# EAGLE design PocketQube (EAGLE 7.1.0)
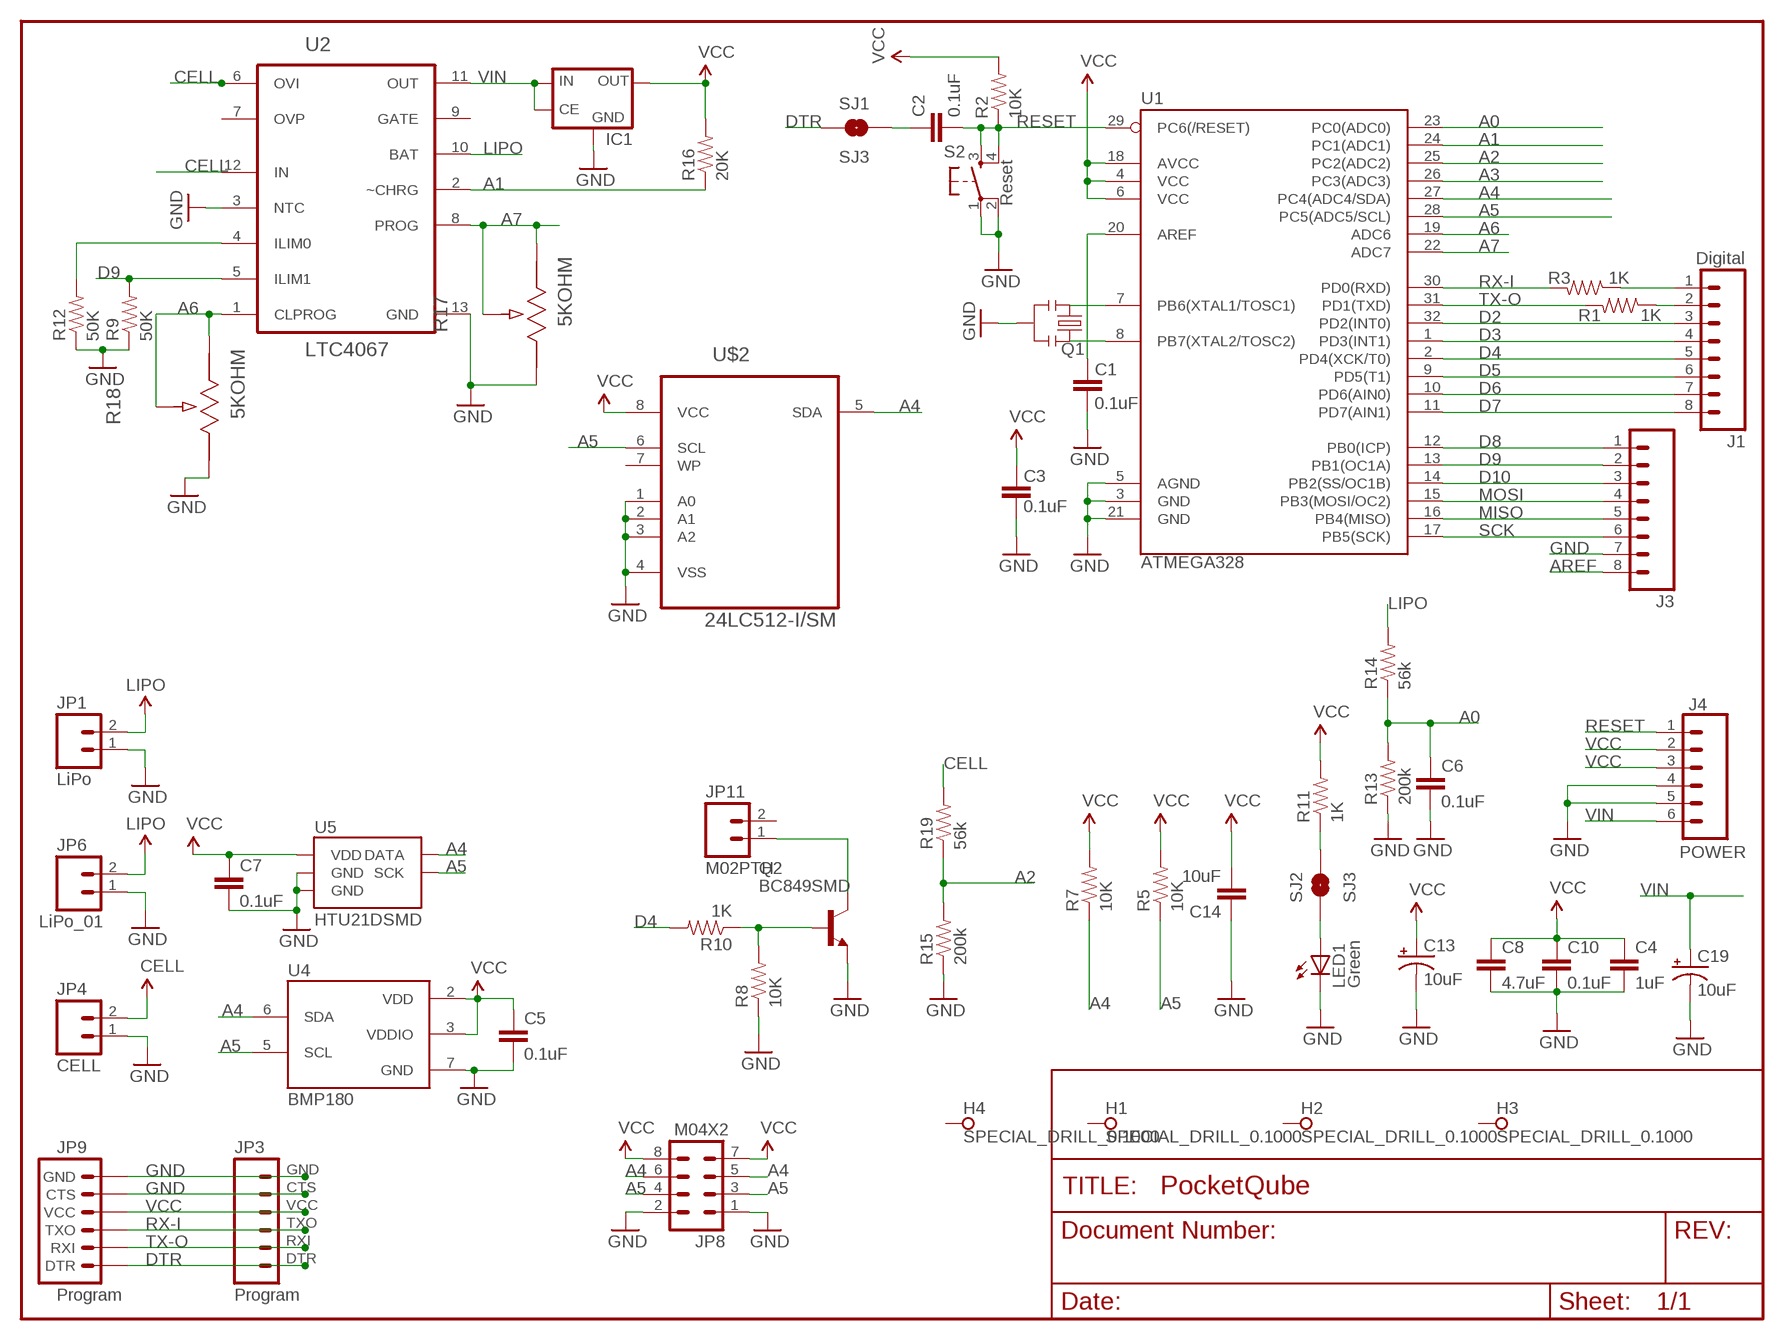
[diagram p0: schematic, sheet 1]

## Parts
C1  0.1uF  CAP0805  [0805]
C2  0.1uF  CAP0805  [0805]
C3  0.1uF  CAP0805  [0805]
C4  1uF  CAP0805  [0805]
C5  0.1uF  CAP0805  [0805]
C6  0.1uF  CAP0805  [0805]
C7  0.1uF  CAP0805  [0805]
C8  4.7uF  CAP0805  [0805]
C10  0.1uF  CAP0805  [0805]
C13  10uF  CAP_POL1206  [EIA3216]
C14  10uF  CAP0805  [0805]
C19  10uF  CAP_POL1206  [EIA3216]
H1  SPECIAL_DRILL_0.1000  [PAD_0.1000]
H2  SPECIAL_DRILL_0.1000  [PAD_0.1000]
H3  SPECIAL_DRILL_0.1000  [PAD_0.1000]
H4  SPECIAL_DRILL_0.1000  [PAD_0.1000]
IC1  XC63FPP  [SOT89R]
J1  Digital  M081X08  [1X08]
J3  M081X08  [1X08]
J4  POWER  M06SIP  [1X06]
JP1  LiPo  M02PTH  [1X02]
JP3  Program  M06SIP  [1X06]
JP4  CELL  M02PTH  [1X02]
JP6  LiPo_01  M02PTH  [1X02]
JP8  M04X2  [2X4]
JP9  Program  ARDUINO_SERIAL_PROGRAMSMD  [1X06-SMD]
JP11  M02PTH  [1X02]
LED1  Green  LG_T679-E1F1-1  [PLCC2]
Q1  8MHZ  RESONATOR8MHZ  [RESONATOR-SMD]
Q2  BC849SMD  [SOT23-BEC]
R1  1K  RESISTOR0805-RES  [0805]
R2  10K  RESISTOR0805-RES  [0805]
R3  1K  RESISTOR0805-RES  [0805]
R5  10K  RESISTOR0805-RES  [0805]
R7  10K  RESISTOR0805-RES  [0805]
R8  10K  RESISTOR0805-RES  [0805]
R9  50K  RESISTOR0805-RES  [0805]
R10  1K  RESISTOR0805-RES  [0805]
R11  1K  RESISTOR0805-RES  [0805]
R12  50K  RESISTOR0805-RES  [0805]
R13  200k  RESISTOR0805-RES  [0805]
R14  56k  RESISTOR0805-RES  [0805]
R15  200k  RESISTOR0805-RES  [0805]
R16  20K  RESISTOR0805-RES  [0805]
R17  5KOHM  EVM2NSX80B53-2N  [POT_EVM2N]
R18  5KOHM  EVM2NSX80B53-2N  [POT_EVM2N]
R19  56k  RESISTOR0805-RES  [0805]
S2  Reset  TAC_SWITCHSMD  [TACTILE_SWITCH_SMD]
SJ1  SJ3  SOLDERJUMPERNC2  [SJ_2S-NOTRACE]
SJ2  SJ3  SOLDERJUMPERNC2  [SJ_2S-NOTRACE]
U1  ATMEGA328  ATMEGA168  [TQFP32-08]
U2  LTC4067  LT3652EDDPBF  [DFN300X300X80-13N]
U4  BMP180  [BMP180]
U5  HTU21DSMD  [HTU21D]
U$2  24LC512-I/SM  [SOIC127P794X203-8N]

## Nets
A0: C6.1 R13.2 R14.1 U1.23(PC0(ADC0))
A1: R16.1 U1.24(PC1(ADC1)) U2.2(~CHRG)
A2: R15.2 R19.1 U1.25(PC2(ADC2))
A3: U1.26(PC3(ADC3))
A4: JP8.5 JP8.6 R7.1 U1.27(PC4(ADC4/SDA)) U4.6(SDA) U5.DATA U$2.5(SDA)
A5: JP8.3 JP8.4 R5.1 U1.28(PC5(ADC5/SCL)) U4.5(SCL) U5.SCK U$2.6(SCL)
A6: R18.2 R18.3 U1.19(ADC6) U2.1(CLPROG)
A7: R17.2 R17.3 U1.22(ADC7) U2.8(PROG)
AREF: C1.2 J3.8 U1.20(AREF)
CELL: JP4.2 R19.2 U2.6(OVI) U2.12(IN)
D2: J1.3 U1.32(PD2(INT0))
D3: J1.4 U1.1(PD3(INT1))
D4: J1.5 R10.2 U1.2(PD4(XCK/T0))
D5: J1.6 U1.9(PD5(T1))
D6: J1.7 U1.10(PD6(AIN0))
D7: J1.8 U1.11(PD7(AIN1))
D8: J3.1 U1.12(PB0(ICP))
D9: J3.2 R9.2 U1.13(PB1(OC1A)) U2.5(ILIM1)
D10: J3.3 U1.14(PB2(SS/OC1B))
DTR: JP3.DTR JP9.1(DTR) SJ1.1
GND [vcc]: C1.1 C3.1 C4.2 C5.2 C6.2 C7.2 C8.2 C10.2 C13.C(-) C14.1 C19.C(-) IC1.2(GND) J3.7 J4.4 J4.5 JP1.1 JP3.CTS JP3.GND JP4.1 JP6.1 JP8.1 JP8.2 JP9.5(CTS) JP9.6(GND) LED1.C Q1.2 Q2.E R8.1 R9.1 R12.1 R13.1 R15.1 R17.1 R18.1 S2.1 S2.2 U1.3(GND) U1.5(AGND) U1.21(GND) U2.3(NTC) U2.13(GND) U4.7(GND) U5.7(GND) U5.GND U$2.1(A0) U$2.2(A1) U$2.3(A2) U$2.4(VSS)
LIPO: JP1.2 JP6.2 R14.2 U2.10(BAT)
MISO: J3.5 U1.16(PB4(MISO))
MOSI: J3.4 U1.15(PB3(MOSI/OC2))
N$1: C2.1 SJ1.2
N$3: Q1.1 U1.8(PB7(XTAL2/TOSC2))
N$4: Q1.3 U1.7(PB6(XTAL1/TOSC1))
N$6: LED1.A SJ2.1
N$8: R11.1 SJ2.2
N$12: JP11.1 Q2.C
N$14: Q2.B R8.2 R10.1
N$16: R12.2 U2.4(ILIM0)
RESET: C2.2 J4.1 R2.1 S2.3 S2.4 U1.29(PC6(/RESET))
RX-I: JP3.TXO JP9.3(TXO) R3.2 U1.30(PD0(RXD))
RX-IP: J1.2 R1.1
SCK: J3.6 U1.17(PB5(SCK))
TX-O: JP3.RXI JP9.2(RXI) R1.2 U1.31(PD1(TXD))
TX-OP: J1.1 R3.1
VCC: C3.2 C4.1 C5.1 C7.1 C8.1 C10.1 C13.A(+) C14.2 IC1.5(OUT) J4.2 J4.3 JP3.VCC JP8.7 JP8.8 JP9.4(VCC) R2.2 R5.2 R7.2 R11.2 R16.2 U1.4(VCC) U1.6(VCC) U1.18(AVCC) U4.2(VDD) U4.3(VDDIO) U5.VDD U$2.8(VCC)
VIN [vcc]: C19.A(+) IC1.1(CE) IC1.4(IN) J4.6 U2.11(OUT)
Unconnected: H1.1 H2.1 H3.1 H4.1 JP11.2 U2.7(OVP) U2.9(GATE) U$2.7(WP)

## Library data of the parts
C1-C8 C10 = SparkFun:CAP: Capacitor Standard 0603 ceramic capacitor, and 0.1" leaded capacitor.
C13 C19 = SparkFun:CAP_POL: Capacitor Polarized These are standard SMD and PTH capacitors. Normally 10uF, 47uF, and 100uF in electrolytic and tantalum varieties. Always verify the external diameter of the through hole cap, it varies with capacity, voltage, and manufacturer. The EIA devices should be standard.
C14 = SparkFun-Passives:CAP: Capacitor Standard 0603 ceramic capacitor, and 0.1" leaded capacitor.
H1-H4 = special-drill:SPECIAL_DRILL_: Special drills
IC1 = SOT89-5:XC63FP: Positiv Voltage Regulators www.torex.co.jp/english/product/pro02/pdf/0201_xc62fp.pdf
J1 J3 = SparkFun:M08: Header 8 Standard 8-pin 0.1" header. Use with straight break away headers (SKU : PRT-00116), right angle break away headers (PRT-00553), swiss pins (PRT-00743), machine pins (PRT-00117), and female headers (PRT-00115).
J4 = SparkFun:M06: Header 6 Standard 6-pin 0.1" header. Use with straight break away headers (SKU : PRT-00116), right angle break away headers (PRT-00553), swiss pins (PRT-00743), machine pins (PRT-00117), and female headers (PRT-00115). Molex polarized connector foot print use with SKU : PRT-08094 with associated ...
JP1 JP4 JP11 = SparkFun-Connectors:M02: Standard 2-pin 0.1" header. Use with - straight break away headers ( PRT-00116) - right angle break away headers (PRT-00553) - swiss pins (PRT-00743) - machine pins (PRT-00117) - female headers (PRT-00115) Molex polarized connector foot print use with: PRT-08233 with associated crimp pins and housings. 2.54_SCREWTERM for use with PRT-10571. 3.5mm Screw Terminal footprints for PRT-08084 5mm Screw Terminal footprints for use with PRT-08432
JP3 = SparkFun-Connectors:M06: Header 6 Standard 6-pin 0.1" header. Use with straight break away headers (SKU : PRT-00116), right angle break away headers (PRT-00553), swiss pins (PRT-00743), machine pins (PRT-00117), and female headers (PRT-00115). Molex polarized connector foot print use with SKU : PRT-08094 with associated ...
JP6 = SparkFun:M02: Header 2 Standard 2-pin 0.1" header. Use with straight break away headers (SKU : PRT-00116), right angle break away headers (PRT-00553), swiss pins (PRT-00743), machine pins (PRT-00117), and female headers (PRT-00115). Molex polarized connector foot print use with SKU : PRT-08233 with associated crimp pins and housings.
JP8 = SparkFun-Connectors:M04X2: .1" header, two rows of four.
JP9 = SparkFun:ARDUINO_SERIAL_PROGRAM
LED1 = led:*_T679-?-1: LC TOPLED® Low Current LED Source: http://catalog.osram-os.com .. LG_LS_LY_T679_OBS.pdf; COLOR: green
Q1 = SparkFun-FreqCtrl:RESONATOR: Resonator Small SMD resonator. Used, eg, on the Arduino Pro/ Pro Mini boards. 8MHz- XTAL-08895 16MHz- XTAL-08900; PROD_ID: XTAL-08895
Q2 = transistor-npn:BC849*: NPN Transistor
R1-R3 R5 R7-R16 R19 = SparkFun:RESISTOR: Resistor Basic schematic elements and footprints for 0603, 1206, and PTH resistors.
R17 R18 = Panasonic-Trimmer_Potentiometers:EVM: Potentiometers; MPN: EVM2NSX80B53; OC_FARNELL: 1849757; OC_NEWARK: 17T5164; PACKAGE: EVM2N; POWERRATING: 0.15W; SUPPLIER: PANASONIC; TOLERANCE: ±25 %
S2 = SparkFun:TAC_SWITCH: Momentary Switch Button commonly used for reset or general input. Spark Fun Electronics SKU : COM-00097
SJ1 SJ2 = SparkFun:SOLDERJUMPER: Solder Jumper Standard SMD solder jumper. Used to automate production. Two varients : Normally Open and Normally Closed are the same, but have different paste layers. NC will have a large amount of paste and should jumper during reflow.
U1 = SparkFun:ATMEGA168
U2 = LTC3067:LT3652EDDPBF: Power Tracking 2A Battery Charger for Solar Power; MPN: LT3652EDD#PBF; OC_FARNELL: 2295370; OC_NEWARK: 62R9142; PACKAGE: DFN-12; SUPPLIER: Linear Technology
U4 = SparkFun-Sensors:BMP180: BOSCH BMP180 DIGITAL BAROMETRIC PRESSURE SENSOR Web page: http://www.bosch-sensortec.com/en/homepage/products_3/environmental_sensors_1/bmp180_1/bmp180 Datasheet: http://ae-bst.resource.bosch.com/media/products/dokumente/bmp180/BST-BMP180-DS000-09.pdf The BMP180 is the function compatible successor of the BMP085, a new generation of high precision digital pressure sensors for consumer applications. The ultra-low power, low voltage electronics of the BMP180 is optimized for use in mobile phones, PDAs, GPS navigation devices and outdoor equipment. With a low altitude noise of merely 0.25m at fast conversion time, the BMP180 offers superior performance. The I2C interface allows for easy system integration with a microcontroller. The BMP180 is based on piezo-resistive technology for EMC robustness, high accuracy and linearity as well as long term stability. Key features: - Temperature measurement included - I2C interface - Fully calibrated - Pb-free, halogen-free and RoHS compliant, - MSL 1 Basic specs: Pressure range: 300 to 1100hPa (+9000m to -500m relating to sea level) Supply voltage: 1.8 to 3.6V (VDD), 1.62V to 3.6V (VDDIO) Package: LGA package with metal lid Small footprint: 3.6mm x 3.8mm Super-flat: 0.93mm height Low power: 5μA at 1 sample / sec. in standard mode Low noise: 0.06hPa (0.5m) in ultra low power mode, 0.02hPa (0.17m) advanced resolution mode Typical applications: - Enhancement of GPS navigation (dead-reckoning, slope detection, etc.) - In- and out-door navigation - Leisure and sports - Weather forecast - Vertical velocity indication (rise/sink speed)
U5 = SparkFun-Sensors:HTU21D
U$2 = 24LC512-I:24LC512-I/SM: 512K I2C Serial EEPROM; MPN: 24LC512-I/SM; OC_FARNELL: 9758038; OC_NEWARK: 62K0582; PACKAGE: SOIC-8; SUPPLIER: MICROCHIP

## Net classes
0 default: width 0.203 mm
1 vcc: width 0.254 mm

## Board
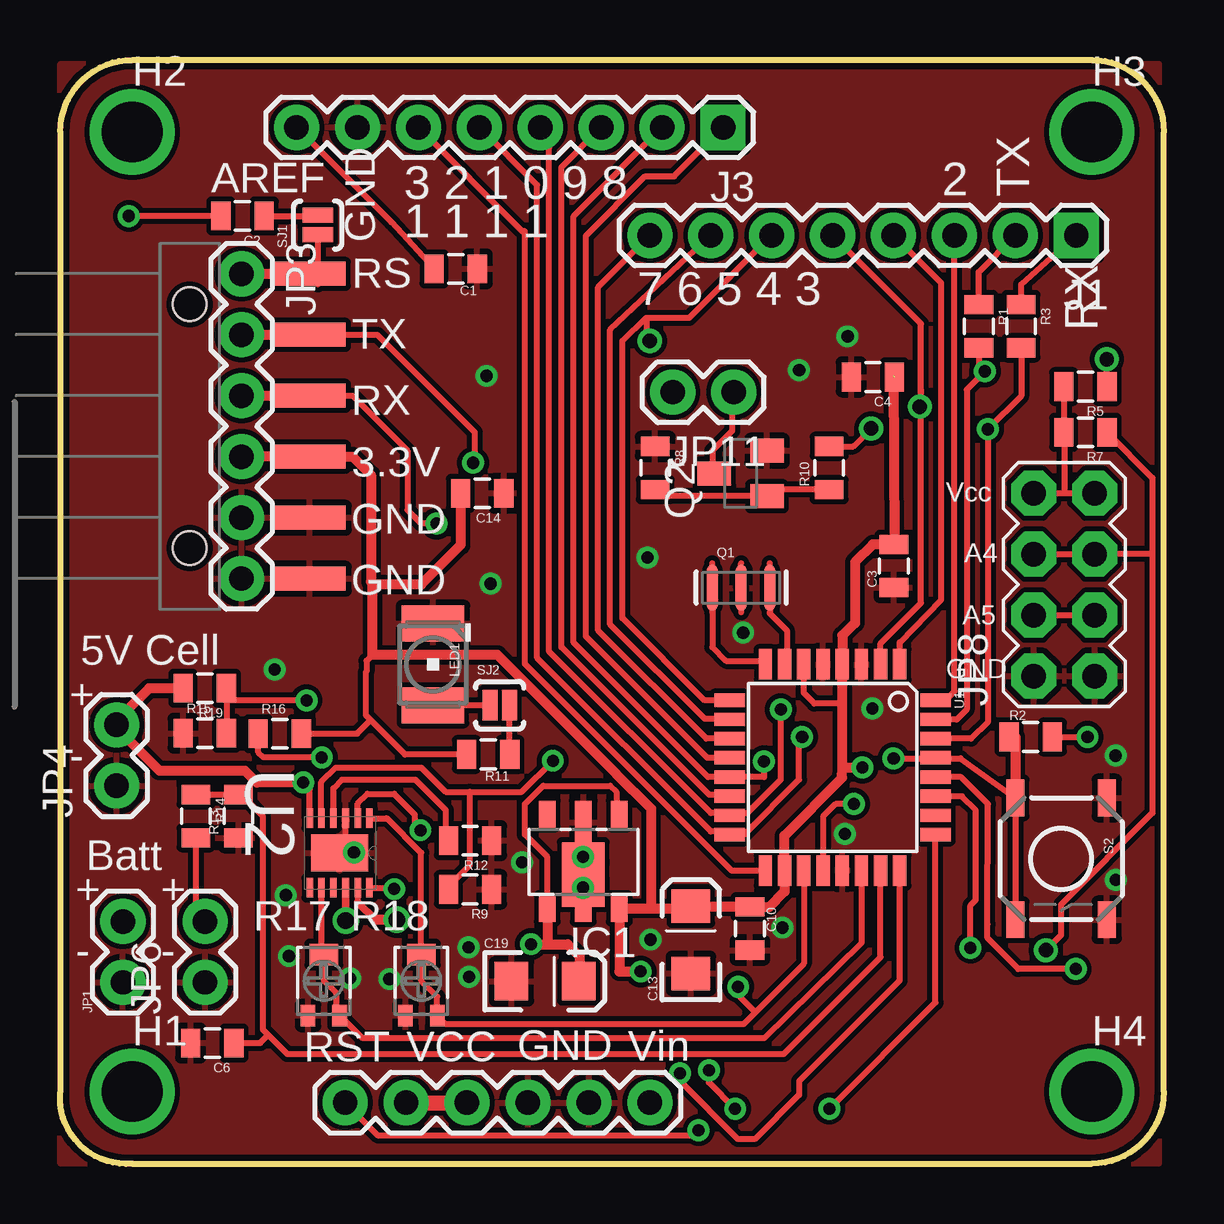
[diagram p1: board, top side]
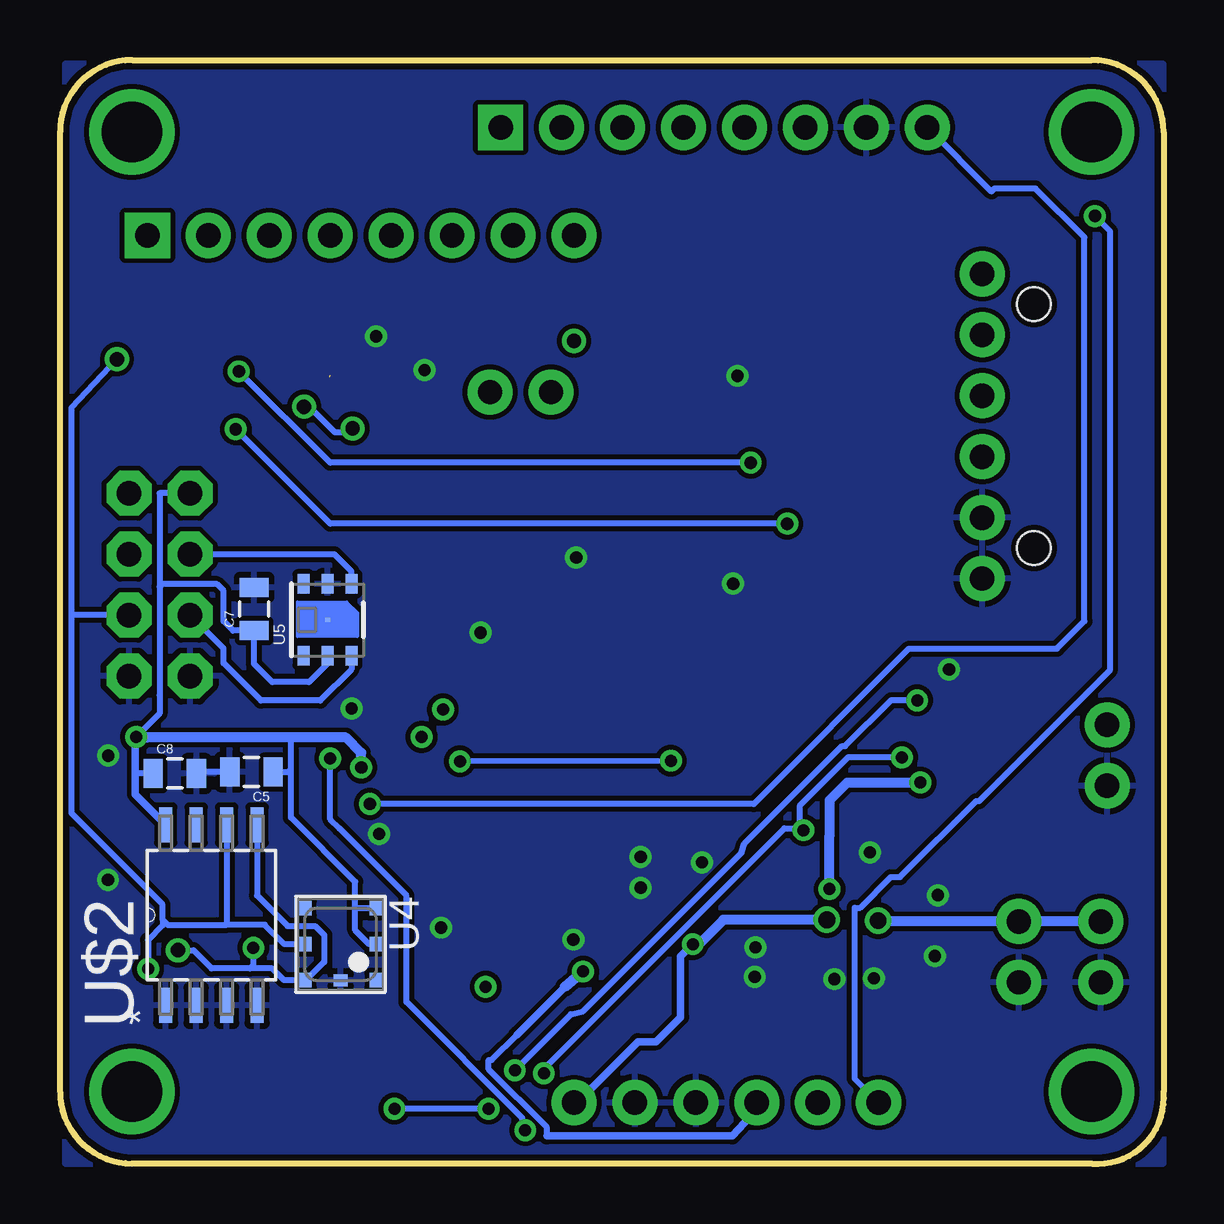
[diagram p2: board, bottom side, seen from below]

Size 46.01 x 46.01 mm. Coordinates in mm from the lower left corner, seen from the top.
Outline: 3.01,0.01 43.01,0.01 arc90 46.01,3.01 46.01,43.01 arc90 43.01,46.01 3.01,46.01 arc90 0.01,43.01 0.01,3.01 arc100 3.01,0.01
Copper layers (1*16): Top 0.035mm / dielectric 1.5mm / Bottom 0.035mm
Design rules "default *": minimum track width 10mil, minimum drill 24mil, track to track 8mil, track to pad 8mil, pad to pad 8mil, via to via 8mil, smd to smd 8mil, copper to edge 10mil, drill to drill 8mil, minimum pad ring 10mil, minimum via ring 8mil, stop-mask expansion 4mil, vias tented up to drill 0mil, thermal gap 10mil

### Footprints (pad centres in the part's own frame; a part is rotated, then mirrored left to right if it is on the bottom)
0805 = smd 0.8 x 1.2: 1 -0.9,0; 2 0.9,0
EIA3216 = smd 1.4 x 1.6: A 1.4,0; C -1.4,0
PAD_0.1000 = drill 2.54 pad 2.54: 1 0,0
SOT89R = smd 0.7 x 1.1: 1 -1.5,-1.75; 3 1.5,-1.75; 4 1.5,2.187; 5 -1.5,2.187 | smd 0.7 x 1.8: 2 0,-1.4; 7 0,1.839 | smd 1.778 x 0.914: 6 0,1.408; 8 0,-0.116; 9 0,0.646; 10 0,1.662
1X08 = drill 1.016 pad 1.88 square: 1 0,0 | drill 1.016 pad 1.88: 2 2.54,0; 3 5.08,0; 4 7.62,0; 5 10.16,0; 6 12.7,0; 7 15.24,0; 8 17.78,0
1X06 = drill 1.016 pad 1.88: 1 0,0; 2 2.54,0; 3 5.08,0; 4 7.62,0; 5 10.16,0; 6 12.7,0
1X02 = drill 1.016 pad 1.88: 1 0,0; 2 2.54,0
1X06' = drill 1.016 pad 1.88: CTS 10.16,0; DTR 0,0; GND 12.7,0; RXI 2.54,0; TXO 5.08,0; VCC 7.62,0
2X4 = drill 1.016 pad 1.88 octagon: 1 -3.81,-1.27; 2 -3.81,1.27; 3 -1.27,-1.27; 4 -1.27,1.27; 5 1.27,-1.27; 6 1.27,1.27; 7 3.81,-1.27; 8 3.81,1.27
1X06-SMD = smd 1 x 3: 1 -6.35,5; 2 -3.81,5; 3 -1.27,5; 4 1.27,5; 5 3.81,5; 6 6.35,5 | hole 1.4: -5.08,0; 5.08,0
PLCC2 = smd 2.6 x 1.5: A 0,1.7; C 0,-1.7
RESONATOR-SMD = smd 0.45 x 1.905: 1 -1.2,0; 2 0,0; 3 1.2,0
SOT23-BEC = smd 1 x 1.4: B -0.95,-1.1; C 0,1.1; E 0.95,-1.1
POT_EVM2N = smd 0.61 x 0.889: 1 -0.66,-1.448; 3 0.66,-1.448 | smd 1.194 x 0.889: 2 0,1.092
TACTILE_SWITCH_SMD = smd 1.524 x 0.762: 1 -2.54,1.905; 2 2.54,1.905; 3 -2.54,-1.905; 4 2.54,-1.905
SJ_2S-NOTRACE = smd 0.635 x 1.27: 1 -0.401,0; 2 0.413,0
TQFP32-08 = smd 1.27 x 0.559: 1 -4.293,2.8; 2 -4.293,2; 3 -4.293,1.2; 4 -4.293,0.4; 5 -4.293,-0.4; 6 -4.293,-1.2; 7 -4.293,-2; 8 -4.293,-2.8; 17 4.293,-2.8; 18 4.293,-2; 19 4.293,-1.2; 20 4.293,-0.4; 21 4.293,0.4; 22 4.293,1.2; 23 4.293,2; 24 4.293,2.8 | smd 0.559 x 1.27: 9 -2.8,-4.293; 10 -2,-4.293; 11 -1.2,-4.293; 12 -0.4,-4.293; 13 0.4,-4.293; 14 1.2,-4.293; 15 2,-4.293; 16 2.8,-4.293; 25 2.8,4.293; 26 2,4.293; 27 1.2,4.293; 28 0.4,4.293; 29 -0.4,4.293; 30 -1.2,4.293; 31 -2,4.293; 32 -2.8,4.293
DFN300X300X80-13N = smd 0.813 x 0.279: 1 -1.448,1.218; 2 -1.448,0.736; 3 -1.448,0.229; 4 -1.448,-0.279; 5 -1.448,-0.786; 6 -1.448,-1.268; 7 1.448,-1.268; 8 1.448,-0.786; 9 1.448,-0.279; 10 1.448,0.229; 11 1.448,0.736; 12 1.448,1.218 | smd 1.549 x 2.388: 13 0,-0.025
BMP180 = smd 0.6 x 0.5: 1 1.5,1.45; 2 0,1.45; 3 -1.5,1.45; 4 -1.5,-1.45; 5 0,-1.45; 6 1.5,-1.45 | smd 0.5 x 0.6: 7 1.5,0
HTU21D = smd 0.2 x 0.2: 7 0,0 | smd 0.8 x 0.5: DATA 1.5,-1; GND 1.5,0; NC@1 -1.5,1; NC@6 1.5,1; SCK -1.5,-1; VDD -1.5,0
SOIC127P794X203-8N = smd 1.473 x 0.559: 1 -3.759,1.905; 2 -3.759,0.635; 3 -3.759,-0.635; 4 -3.759,-1.905; 5 3.759,-1.905; 6 3.759,-0.635; 7 3.759,0.635; 8 3.759,1.905

### Placement (x,y rotation side)
C1  16.49,37.3 180 top
C2  7.61,39.51 180 top
C3  34.76,24.92 90 top
C4  33.88,32.8 180 top
C5  38.03,16.33 180 bottom
C6  6.35,5.03 180 top
C7  37.92,23.13 90 bottom
C8  41.22,16.27 0 bottom
C10  28.76,9.81 270 top
C13  26.29,9.33 90 top
C14  17.6,27.95 180 top
C19  20.22,7.61 0 top
H1  3.01,3.01 0 top
H2  3.01,43.01 0 top
H3  43.01,43.01 0 top
H4  43.01,3.01 0 top
IC1  21.82,12.83 180 top
J1  42.37,38.7 180 top
J3  27.64,43.2 180 top
J4  11.89,2.55 0 top
JP1  2.62,7.56 90 top
JP3  Program  [1X06']  7.57,37.1 270 top
JP4  2.36,15.76 90 top
JP6  6.04,7.56 90 top
JP8  41.86,24.14 90 top
JP9  5.41,30.75 270 top
JP11  28.08,32.17 180 top
LED1  15.55,20.81 180 top
Q1  28.39,24.01 0 top
Q2  28.38,28.78 90 top
R1  38.3,34.91 270 top
R2  40.46,17.79 0 top
R3  40.06,34.91 270 top
R5  42.75,32.4 180 top
R7  42.75,30.49 180 top
R8  24.81,29.01 270 top
R9  17.09,11.44 180 top
R10  32.07,29 90 top
R11  17.85,17.06 180 top
R12  17.09,13.47 180 top
R13  7.44,14.49 90 top
R14  5.66,14.49 270 top
R15  6.04,17.95 0 top
R16  9.16,17.93 0 top
R17  11,7.63 0 top
R18  15.06,7.63 0 top
R19  6.04,19.82 180 top
S2  41.73,12.71 270 top
SJ1  10.74,39.13 90 top
SJ2  18.33,19.11 0 top
U1  32.21,16.52 270 top
U2  11.68,12.95 270 top
U4  34.31,9.15 270 bottom
U5  34.86,22.68 90 bottom
U$2  39.7,10.37 90 bottom

### Tracks (layer width: path | path; a pad name or v marks a point on that pad's centre or on a via)
A0
  Top 0.254: U1.23 34.21,8.62 30.17,4.58 29.16,4.58 9.47,4.58 8.68,5.37 | R14.1 R13.2 7.33,15.25 7.7,15.25 8.46,14.49 8.46,5.6 8.68,5.37 | C6.1 8.35,5.03 8.68,5.37
A1  (via drill 0.5 pad 0.41)
  Top 0.254: U1.24 35.01,7.64 30.81,3.44 30.81,2.87 28.97,1.03 28.27,1.03 25.84,3.45 v25.84,3.78 | v15.02,13.9 14.84,13.9 14.78,13.96 14.78,14.56 13.93,15.42 12.82,15.42 12.41,15.02 U2.2 | v10.91,16.94 8.48,16.94 8.27,17.15 R16.1
  Bottom 0.254: v10.91,16.94 13.16,16.94 15.19,14.91 15.19,14.07 v15.02,13.9 15.1,13.98 15.82,13.98 25.84,3.96 v25.84,3.78
A2  (via drill 0.5)
  Top 0.254: U1.25 36.5,6.73 v32.07,2.3 | 6.79,18.06 R15.2 6.94,17.82 R19.1 7.06,19.32 v10.28,19.32 | v27.05,3.9 27.05,3.39 v28.14,2.3
  Bottom 0.254: v27.05,3.9 24.71,6.23 24.21,6.36 17.6,12.97 17.47,13.35 13.41,17.41 13.28,17.41 11.38,19.32 v10.28,19.32 | v28.14,2.3 v32.07,2.3
A4  (via drill 0.5, 0.6)
  Top 0.254: U1.27 37.6,15.32 38.18,14.74 38.18,11 37.95,10.77 v37.95,9 | R7.1 43.65,30.48 45.54,28.59 45.54,25.41 | 45.54,25.41 JP8.5 JP8.6 | 45.54,25.41 45.54,14.62 41.73,10.81 41.73,9.54 v41.1,8.9
  Bottom 0.254: U5.DATA 33.86,24.7 34.57,25.41 JP8.6 | v41.1,8.9 40.45,8.9 39.69,8.15 38.09,8.15 | 38.09,8.15 37.16,8.15 36.67,7.65 U4.6 35,8.42 35,9.54 35.38,9.92 36.52,9.92 37.79,11.19 37.79,14.11 U$2.5 | v37.95,9 37.95,8.28 38.09,8.15
A5  (via drill 0.5, 0.6)
  Top 0.254: U1.28 37.56,16.12 38.68,15 38.66,9.99 38.66,9.41 39.95,8.12 v42.34,8.12 | v43.64,33.54 43.64,32.4 R5.1 | JP8.4 JP8.3
  Bottom 0.254: JP8.3 45.54,22.87 | 45.54,22.87 45.54,14.62 41.73,10.81 41.73,10.17 | v43.64,33.54 45.54,31.51 45.54,22.87 | 41.73,10.17 41.5,9.94 39.09,9.94 39.06,9.97 | U5.SCK 33.86,20.61 35.16,19.31 37.63,19.31 39.2,20.87 39.2,21.48 JP8.4 | 41.73,10.17 41.73,9.93 42.34,9.32 v42.34,8.13 v42.34,8.12 | U$2.6 39.06,9.97 | U4.5 36.66,9.15 37.47,9.97 39.06,9.97
A6  (via drill 0.5)
  Top 0.254: U1.19 31.01,8.34 28.99,6.32 | v28.27,7.38 28.27,7.03 28.99,6.32 | U2.1 13.6,14.4 13.61,14.41 15.06,12.97 R18.2 15.06,7.63 15.72,6.97 R18.3 16.08,5.82 28.49,5.82 28.99,6.32
A7
  Top 0.254: U1.22 33.41,9.21 29.35,5.24 12.62,5.23 R17.3 11.51,6.34 11.51,7.12 11,7.63 R17.2 10.89,8.83 U2.8
AREF  (via drill 0.51)
  Top 0.254: U1.20 31.81,14.47 32.33,15 v33.1,15 | C1.2 13.82,39.25 J3.8
  Bottom 0.254: v33.1,15 17.09,15 10.62,21.47 4.46,21.47 3.31,22.62 3.31,38.62 5.35,40.65 7.06,40.65 7.19,40.52 J3.8
CELL  (via drill 0.5, 0.5 pad 0.41)
  Top 0.254: U2.12 13.61,11.51 v13.94,11.45 | U2.6 10.41,15.62 v10.14,15.89 | 2.69,17.84 2.69,17.97 JP4.2
  Top 0.406: v10.14,15.89 8.21,15.89 7.71,16.39 4.14,16.39 2.69,17.84 | R19.2 3.71,19.82 2.69,18.8 2.62,18.8 2.62,18.56 JP4.2
  Bottom 0.406: v13.94,11.45 13.94,13.69 13.93,13.69 13.93,15.15 13.19,15.89 v10.14,15.89
D2
  Top 0.254: U1.32 36.9,19.32 36.91,19.32 37.29,19.7 J1.3
D3
  Top 0.254: U1.1 35.01,21.73 36.73,23.51 36.73,36.71 J1.4
D4  (via drill 0.6)
  Top 0.254: U1.2 34.21,21.7 35.89,23.38 35.89,32.27 | 35.89,32.27 35.89,35.02 J1.5 | 35.89,32.27 v35.84,31.56 | R10.2 33.06,29.9 v33.81,30.65
  Bottom 0.254: v35.84,31.56 35.62,31.56 34.56,30.49 33.97,30.49 v33.81,30.65
D5  (via drill 0.6)
  Top 0.254: U1.9 28.02,19.32 | U1.9 | U1.9 26.87,19.32 23.44,22.74 23.44,34.3 24.44,35.26 | 24.44,35.26 26.23,35.26 J1.6 | 24.44,35.26 24.44,34.44 v24.59,34.3
D6
  Top 0.254: U1.10 27.79,18.52 27.76,18.55 26.87,18.55 22.94,22.49 22.94,34.76 J1.7
D7
  Top 0.254: U1.11 26.94,17.72 22.43,22.24 22.43,36.54 J1.8
D8
  Top 0.254: U1.12 26.98,16.92 21.92,21.98 21.92,38.68 24.4,41.16 25.6,41.16 J3.1
D9  (via drill 0.5)
  Top 0.254: v29.34,16.78 29.34,16.12 28.02,16.12 U1.13 27.02,16.12 21.41,21.73 21.41,39.51 J3.2 | R9.2 16.19,11.56 17.09,12.46 17.09,15.51 | 17.09,15.51 16.08,15.51 15.06,16.52 11.51,16.52 10.89,15.91 U2.5 | 17.09,15.51 19.25,15.51 v20.55,16.8
  Bottom 0.254: v20.55,16.8 v29.34,16.78
D10
  Top 0.254: U1.14 27.89,15.35 27.89,15.38 27.06,15.38 20.9,21.54 20.9,41.54 J3.3
DTR
  Top 0.254: SJ1.1 10.74,36.67 JP9.1
  Top 0.406: JP3.DTR JP9.1
GND  (via drill 0.51)
  Top 0.254: v30.12,9.84 30.07,9.84 30.04,9.87 | v21.81,12.8 IC1.2 | v12.25,12.98 12.25,13.16 11.91,13.51 U2.3
  Bottom 0.254: C5.2 40.26,16.33 C8.2
  other vias: 28.48,22.14 17.95,24.18 44,17.01 30.81,33.09 33.86,18.99 17.05,7.79 24.49,25.27 24.61,9.35 32.83,34.49 44.01,11.84 8.95,20.6 9.41,11.2 12.09,7.73 21.81,11.51 32.71,13.75 19.25,12.56 17.03,9.03 13.73,7.7 9.54,8.66 17.78,32.85
  pour Top: 0.01,45.85 45.81,45.85 45.81,0.01 0.01,0.01
  pour Bottom: 0.01,45.85 45.81,45.85 45.81,0.01 0.01,0.01
LIPO  (via drill 0.7)
  Top 0.254: R14.2 5.66,10.48 JP6.2
  Top 0.305: U2.10 v11.91,10.13
  Bottom 0.254: 11.94,10.1 v11.91,10.13
  Bottom 0.406: 11.94,10.1 JP6.2 JP1.2
MISO  (via drill 0.51)
  Top 0.254: U1.16 | U1.16 28.01,13.72 28.02,13.73 28.52,13.73 30.81,16.01 30.81,17.66 v30.94,17.79 | U1.16 27.91,13.75 28.02,13.85 27.13,13.85 19.89,21.09 19.89,40.79 J3.5
MOSI  (via drill 0.51)
  Top 0.254: 28.02,14.49 27.95,14.49 U1.15 | v30.05,18.93 30.05,16.01 28.65,14.62 28.14,14.62 28.02,14.49 | 28.02,14.49 27.98,14.52 U1.15 | U1.15 27.91,14.59 27.89,14.62 27.13,14.62 20.4,21.35 20.4,42.37 20.08,42.68 20.08,43.14 J3.4
N$1
  Top 0.254: C2.1 10.71,39.51 SJ1.2
N$3
  Top 0.254: U1.8 29.25,20.97 27.76,20.97 27.19,21.54 Q1.1
N$4
  Top 0.254: U1.7 30.3,20.91 30.3,22.24 29.59,22.95 Q1.3
N$6
  Top 0.254: SJ2.1 LED1.A
N$8
  Top 0.254: R11.1 SJ2.2
N$12
  Top 0.254: JP11.1 28.01,32.09 28.01,30.55 27.19,29.73 27.19,28.87 Q2.C
N$14
  Top 0.254: R10.1 29.75,28.1 Q2.B 25.09,27.83 R8.2
N$16
  Top 0.254: R12.2 16.08,13.59 16.08,14.74 14.81,16.01 11.76,16.01 11.4,15.65 U2.4
N$20
  pour Bottom: 39.83,15.38 40.84,15.38 40.84,15.12 39.83,15.12
N$25
  pour Bottom: 39.7,15.25 39.7,15
N$26
  pour Bottom: 15.82,3.06 15.57,3.06 15.57,2.04 15.82,2.04
RESET  (via drill 0.5 pad 0.41, 0.51)
  Top 0.254: J4.1 13.26,1.17 26.57,1.17 v26.62,1.4 | v34.75,16.9 36.4,16.9 36.42,16.92 U1.29 36.63,16.92 36.65,16.9 37.54,16.9 S2.3 S2.4 | C2.2 v2.87,39.51
  Top 0.406: R2.1 39.83,17.79 S2.3
  Bottom 0.254: v34.75,16.9 34.74,14.36 34.36,13.98 34.37,13.98 31.57,11.19 31.57,6.74 26.75,1.92 26.75,1.52 v26.62,1.4 | J4.1 12.89,3.55 12.89,10.67 12.66,10.67 11.38,11.95 11,11.95 7.82,15.12 7.7,15.12 2.23,20.59 2.23,38.87 v2.87,39.51
RX-I  (via drill 0.51)
  Top 0.254: U1.30 37.98,17.72 38.68,18.43 v38.68,30.62 40.06,32 R3.2 | v15.7,26.68 15.06,26.68 14.49,27.25 14.49,29.73 12.2,32.02 JP9.3
  Top 0.406: JP3.TXO JP9.3
  Bottom 0.254: v38.68,30.62 34.75,26.68 v15.7,26.68
RX-IP
  Top 0.254: R1.1 38.3,37.17 J1.2
SCK
  Top 0.254: U1.17 27.99,12.23 19.38,20.84 19.38,38.87 19.27,38.87 J3.6
TX-O  (via drill 0.51)
  Top 0.254: U1.31 37.38,18.52 37.79,18.93 37.79,32.27 v38.56,33.03 38.3,33.29 R1.2 | JP9.2 13.22,34.56 17.28,30.49 17.28,29.28 v17.22,29.22
  Top 0.406: JP3.RXI JP9.2
  Bottom 0.254: v38.56,33.03 34.75,29.22 v17.22,29.22
TX-OP
  Top 0.254: R3.1 40.06,36.65 J1.1
VCC  (via drill 0.5, 0.51)  (1 unrouted)
  Top 0.254: U1.18 30.2,12.24 | 32.61,20.92 U1.4 | U1.6 31.01,19.63 31.44,19.19 32.61,19.19 | R2.2 v42.83,17.79 | JP8.8 41.86,27.95 | 41.86,27.95 JP8.7 | R5.2 R7.2 41.86,27.95 | 16.97,27.97 C14.2 | 16.7,25.78 | 13.03,21.22 12.78,20.97 12.78,20.52 12.76,20.5 12.76,18.69 12.95,18.5 | 13.03,24.05 13.1,24.12 | R11.2 14.38,17.06 12.95,18.5 | 23.17,16.29 23.17,16.28 | 24.64,10.71 24.71,10.64 | R16.2 12.39,17.93 12.95,18.5
  Top 0.406: 30.2,12.24 30.19,13.67 32.6,16.09 32.61,16.52 | 32.61,16.52 32.61,19.19 U1.4 | 32.61,16.52 v33.45,16.52 | 34.75,32.85 34.77,25.92 C3.2 33.88,25.82 33.14,25.08 33.14,22.54 32.61,22.03 32.61,20.84 U1.4 | 16.7,25.78 C14.2 16.71,27.96 | 16.7,25.78 15.06,24.14 13.12,24.14 13.1,24.12 12.97,24.25 12.97,28.71 12.2,29.48 JP9.4 JP3.VCC | 26.01,10.45 C13.A | C13.A 28.73,10.73 C10.1 29.57,10.71 30.21,11.35 U1.18 | 23.17,16.29 18.24,21.22 13.03,21.22 13.03,24.05 | C13.A 26.2,10.64 24.71,10.64 IC1.5 23.32,8.01 v24.21,8.01 | 23.17,16.28 24.64,14.81 24.64,10.71
  Top 0.635: J4.2 J4.3
  Bottom 0.254: 42.39,17.77 v42.83,17.79 41.86,18.76 41.86,19.54 41.86,24.05 | JP8.8 41.86,27.95 41.86,24.05 | 41.86,24.05 41.75,24.16 39.46,24.16 39.19,23.89 39.19,22.62 38.8,22.23 C7.1 37.92,20.84 37.16,20.08 35.64,20.08 34.86,20.85 U5.VDD | U4.2 33.12,9.15 33.71,9.74 33.71,10.68 | 33.71,10.68 33.71,11.76 36.38,14.43 36.38,16.45 | 36.38,16.45 36.38,17.71 36.43,17.77 | C5.1 36.5,16.33 36.38,16.45 | C8.1 42.87,16.27 | 25.71,1.16 25.71,1.52 28.14,3.95 28.14,4.33 28.02,4.33 26.96,5.38 | U4.3 33.68,10.65 33.71,10.68
  Bottom 0.305: 25.71,1.16 17.98,1.16 16.97,2.28 J4.3 | 26.96,5.38 24.97,7.38 | v42.83,17.79 42.87,17.75 42.87,16.27 42.87,15.4 U$2.8
  Bottom 0.406: v33.45,16.52 33.45,17.13 34.09,17.77 36.43,17.77 42.39,17.77 | 24.97,7.38 v24.21,8.01
VIN  (via drill 0.5, 0.7)
  Top 0.254: 21.67,7.66 C19.A | IC1.4 20.32,12.79 19.38,13.73 19.38,15 20.14,15.76 22.94,15.76 23.19,15.51 23.19,14.71 IC1.1 | U2.11 12.41,10.9
  Top 0.305: 12.41,10.9 13.15,10.17
  Top 0.406: v19.63,9.16 20.32,9.16 | 20.32,9.16 21.16,9.16 21.67,8.65 21.67,7.66 | v14.05,10.17 13.15,10.17 | IC1.4 20.32,9.16
  Bottom 0.305: J4.6 24.46,2.55 21.92,5.09 21.16,5.09 20.14,6.11 20.14,8.65 v19.63,9.16
  Bottom 0.406: v14.05,10.17 18.36,10.17 19.38,9.16 v19.63,9.16

### Text on the board
tPlace: AREF | 3 2 1 0 9 8 | 2 | TX | 1 1 1 1 | GND | RS | 7 6 5 4 3 | RX | TX | RX | 3.3V | Vcc | GND | A4 | GND | A5 | 5V Cell | GND | + | - | Batt | + | + | - | - | RST | Vin | VCC | GND
tValues: DNP | DNP | JST-Right Angle | DNP | Production: DNP | Production: DNP | Proto: 2x3 male header up | DNP | DNP | DNP